# Altium schematic sheet Audio_Video Controller.SchDoc: Audio_Video Controller
size A4; Organization: Altium Limited; Address1: L3, 12a Rodborough Rd; Address2: Frenchs Forest; Address3: NSW; Address4: Australia 2086; Revision: 1; SheetNumber: 4; SheetTotal: 11; Alumno: Diego Caceres; Curso: R1051; Materia: Sistemas de Representación; Docentes: Ing. Perdomo, Ing. Fuoco, Ing. Giorno, Sr. Vergili
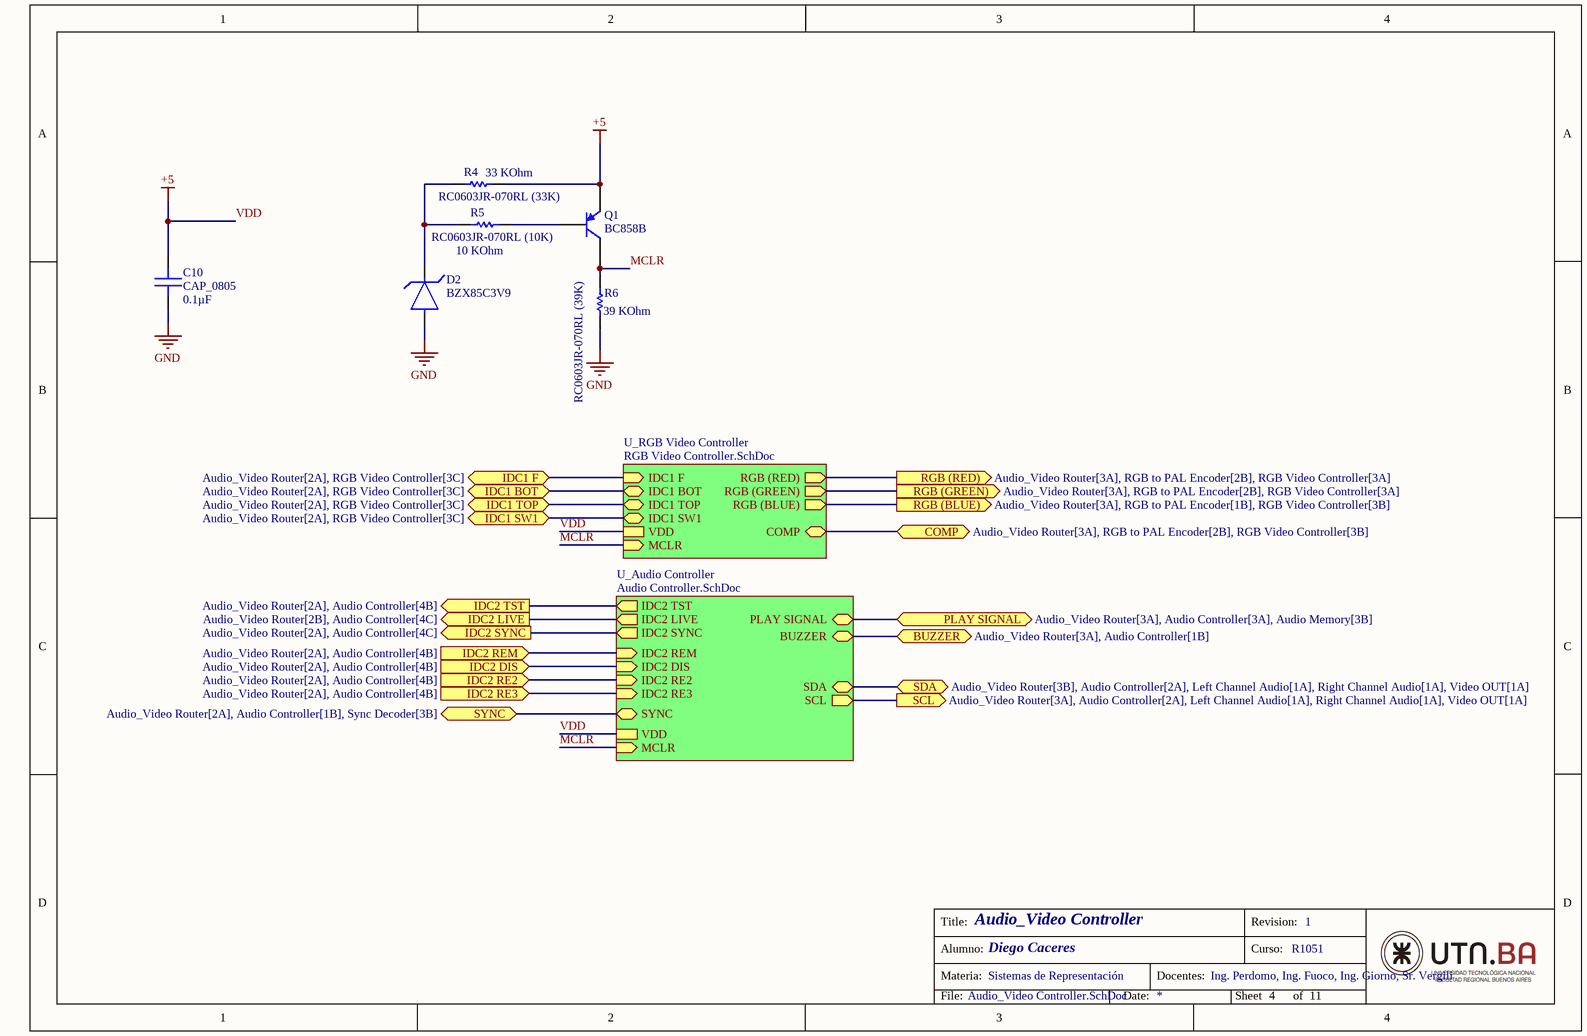
[diagram p0: Audio_Video Controller.SchDoc]

## Parts
C10  CAP_0805  value 0.1µF  [0805_CAPACITOR_DCACERES]
D2  BZX85C3V9  [AXIAL_LEAD_D0-41_BZX85C3V9_DCACERES]
Q1  BC858B  [INF-SOT23_M]
R4  RC0603JR-070RL (33K)  Resistance: 33 KOhm  [RESC1608X55X25ML10T15]
R5  RC0603JR-070RL (10K)  Resistance: 10 KOhm  [RESC1608X55X25ML10T15]
R6  RC0603JR-070RL (39K)  Resistance: 39 KOhm  [RESC1608X55X25ML10T15]

## Sub-sheets
U_Audio Controller = Audio Controller.SchDoc: IDC2 TST (out), IDC2 LIVE (out), IDC2 SYNC (out), IDC2 REM (in), IDC2 DIS (in), IDC2 RE2 (in), IDC2 RE3 (in), PLAY SIGNAL (bidir), SYNC (bidir), MCLR (in), VDD, SCL (out), SDA (bidir), BUZZER (bidir)
U_RGB Video Controller = RGB Video Controller.SchDoc: IDC1 F (in), IDC1 BOT (bidir), IDC1 TOP (bidir), IDC1 SW1 (bidir), RGB (BLUE) (out), RGB (GREEN) (out), RGB (RED) (out), VDD, COMP (bidir), MCLR (in)

## Ports
BUZZER (bidir, see Audio_Video Router[3A], Audio Controller[1B]), COMP (bidir, see Audio_Video Router[3A], RGB to PAL Encoder[2B], RGB Video Controller[3B]), IDC1 BOT (bidir, see Audio_Video Router[2A], RGB Video Controller[3C]), IDC1 F (bidir, see Audio_Video Router[2A], RGB Video Controller[3C]), IDC1 SW1 (bidir, see Audio_Video Router[2A], RGB Video Controller[3C]), IDC1 TOP (bidir, see Audio_Video Router[2A], RGB Video Controller[3C]), IDC2 DIS (in, see Audio_Video Router[2A], Audio Controller[4B]), IDC2 LIVE (out, see Audio_Video Router[2B], Audio Controller[4C]), IDC2 RE2 (in, see Audio_Video Router[2A], Audio Controller[4B]), IDC2 RE3 (in, see Audio_Video Router[2A], Audio Controller[4B]), IDC2 REM (in, see Audio_Video Router[2A], Audio Controller[4B]), IDC2 SYNC (out, see Audio_Video Router[2A], Audio Controller[4C]), IDC2 TST (out, see Audio_Video Router[2A], Audio Controller[4B]), PLAY SIGNAL (bidir, see Audio_Video Router[3A], Audio Controller[3A], Audio Memory[3B]), RGB (BLUE) (out, see Audio_Video Router[3A], RGB to PAL Encoder[1B], RGB Video Controller[3B]), RGB (GREEN) (out, see Audio_Video Router[3A], RGB to PAL Encoder[2B], RGB Video Controller[3A]), RGB (RED) (out, see Audio_Video Router[3A], RGB to PAL Encoder[2B], RGB Video Controller[3A]), SCL (out, see Audio_Video Router[3A], Audio Controller[2A], Left Channel Audio[1A], Right Channel Audio[1A], Video OUT[1A]), SDA (bidir, see Audio_Video Router[3B], Audio Controller[2A], Left Channel Audio[1A], Right Channel Audio[1A], Video OUT[1A]), SYNC (bidir, see Audio_Video Router[2A], Audio Controller[1B], Sync Decoder[3B])

## Nets
GND: C10.1 D2.1 R6.2
VDD: C10.2 Q1.2(E) R4.1 ; sheet U_RGB Video Controller/VDD, sheet U_Audio Controller/VDD  [also labelled +5]
BUZZER: port BUZZER, sheet U_Audio Controller/BUZZER
COMP: port COMP, sheet U_RGB Video Controller/COMP
IDC1 BOT: port IDC1 BOT, sheet U_RGB Video Controller/IDC1 BOT
IDC1 F: port IDC1 F, sheet U_RGB Video Controller/IDC1 F
IDC1 SW1: port IDC1 SW1, sheet U_RGB Video Controller/IDC1 SW1
IDC1 TOP: port IDC1 TOP, sheet U_RGB Video Controller/IDC1 TOP
IDC2 DIS: port IDC2 DIS, sheet U_Audio Controller/IDC2 DIS
IDC2 LIVE: port IDC2 LIVE, sheet U_Audio Controller/IDC2 LIVE
IDC2 RE2: port IDC2 RE2, sheet U_Audio Controller/IDC2 RE2
IDC2 RE3: port IDC2 RE3, sheet U_Audio Controller/IDC2 RE3
IDC2 REM: port IDC2 REM, sheet U_Audio Controller/IDC2 REM
IDC2 SYNC: port IDC2 SYNC, sheet U_Audio Controller/IDC2 SYNC
IDC2 TST: port IDC2 TST, sheet U_Audio Controller/IDC2 TST
MCLR: Q1.3(C) R6.1 ; sheet U_RGB Video Controller/MCLR, sheet U_Audio Controller/MCLR
PLAY SIGNAL: port PLAY SIGNAL, sheet U_Audio Controller/PLAY SIGNAL
RGB (BLUE): port RGB (BLUE), sheet U_RGB Video Controller/RGB (BLUE)
RGB (GREEN): port RGB (GREEN), sheet U_RGB Video Controller/RGB (GREEN)
RGB (RED): port RGB (RED), sheet U_RGB Video Controller/RGB (RED)
SCL: port SCL, sheet U_Audio Controller/SCL
SDA: port SDA, sheet U_Audio Controller/SDA
SYNC: port SYNC, sheet U_Audio Controller/SYNC
NetD2_2: D2.2 R4.2 R5.2
NetQ1_1: Q1.1(B) R5.1

## Notes on the sheet
- Title:
- Revision:
- Alumno:
- Materia:
- Docentes:
- Curso:
- File:
- Date:
- Sheet
- of

## Library data of the parts
C10 = CAPACITOR_0805_Caceres: Capacitor SMD, encapsulado 0805; SizePackage: 0805; ComponentLink1Description: Datasheet1; ComponentLink1URL: https://www.mouser.com/datasheet/2/40/AutoMLCCKAM-3216307.pdf; ComponentLink2Description: Datasheet2; ComponentLink2URL: https://www.mouser.com/datasheet/2/447/KEM_C1086_U2J-3316409.pdf; ComponentLink3Description: Datasheet3; ComponentLink3URL: https://product.tdk.com/system/files/dam/doc/product/capacitor/ceramic/mlcc/catalog/mlcc_commercial_soft_en.pdf
D2 = BZX85C3V9_Caceres: Diodo Zener 3.9V, BZX85C3V9, Thru Hole; PartNumber: BZX85C3V9-TR; Manufacturer: Fairchild Semiconductor; Package: DO-41; ZenerVoltage: 3.9V; ComponentLink1Description: Datasheet1; ComponentLink1URL: https://www.mouser.com/datasheet/2/308/BZX85C3V9-1300112.pdf; ComponentLink2Description: Datasheet2; ComponentLink2URL: https://www.vishay.com/docs/85607/bzx85.pdf
Q1 = CMP-1177-00040-1: PNP Silicon AF Transistor, 30 V VCEO, 100 mA IC, SOT23, Reel, Green; Manufacturer: Infineon; VCEO (max): 30Â V; Ptot (max): 330Â mW; Green: TRUE; ICBO (max): 15Â nA; fT (typ): 250Â MHz; ICM (max): 200Â mA; IC (max): 100Â mA; VEBO (max): 5Â V; PartNumber: BC858B; PackageVersion: Apr-08; VCBO (max): 30Â V; ComponentLink1Description: Manufacturer URL; PackageReference: SOT23; ComponentLink2URL: http://www.infineon.com/dgdl/bc857series_bc858series_bc859series_bc860series.pdf?folderId=db3a304314dca389011541d30fa21656&fileId=db3a304314dca389011541da0e3a1661; ComponentLink3URL: http://www.infineon.com/dgdl/SOT23-Package_Overview.pdf?folderId=db3a30431936bc4b0119532290053c66&fileId=db3a30431936bc4b0119533468123c85; ComponentLink1URL: http://www.infineon.com/; Polarity: PNP; ComponentLink2Description: Datasheet; Packing: Reel; PackageDescription: 3-Pin Small Outline Transistor Package, 1.3 x 2.9 mm Body, 0.95 mm Pitch; Mounting Technology: Surface Mount; IBM (max): 200Â mA; ComponentLink3Description: Package Specification
R4-R6 = CMP-2100-03667-1: Chip Resistor, 0 Ohm, +/- 5%, 0.1 W, -55 to 155 degC, 0603 (1608 Metric), RoHS, Tape and Reel; Manufacturer: Yageo; Temperature Coefficient: 200ppm/degreesC; Voltage Rating: 50V; Power Rating: 100mW; Width: 0.8mm; Max Operating Temperature: 155degC; Tolerance: 5%; Package Reference: 0603; Height: 0.45mm; Depth: 0.8mm; Package Description: 2-Pin Surface Mount Device, Body 1.6 x 0.8 mm; Termination: SMD/SMT; Package Quantity: 5000; Case/Package: 0603; Case Code (Imperial): 0603; Radiation Hardening: No; Number of Pins: 2; Length: 1.6mm; Lead Free: LeadFree; Voltage Rating (DC): 50V; Military Standard: Not; Datasheet URL: http://www.yageo.com/NewPortal/yageodocoutput?fileName=/pdf/R-Chip/PYu-RC_Group_51_RoHS_L_5.pdf; Manufacturer URL: http://www.yageo.com/; Packaging: TapeandReel; Case Code (Metric): 1608; Min Operating Temperature: -55degC; Composition: ThickFilm; RoHSCompliant: true; Contact Plating: Tin; Datasheet Version: Rev. 5, 10/2016; REACH SVHC: NoSVHC